# EasyEDA Pro project ProPrj_智能视觉集成板-V1.0.epro, schematic Schematic1

## Sheets
1 母版 连接器: Board Name: 母板; Create Date: 2024-11-23; Page Name: 母版 连接器; Project Name: 009-智能视觉集成板-V1.0; Schematic Name: Schematic1; Update Date: 2024-12-03; Company: 嘉立创EDA; Page Size: A4; Version: V1.0
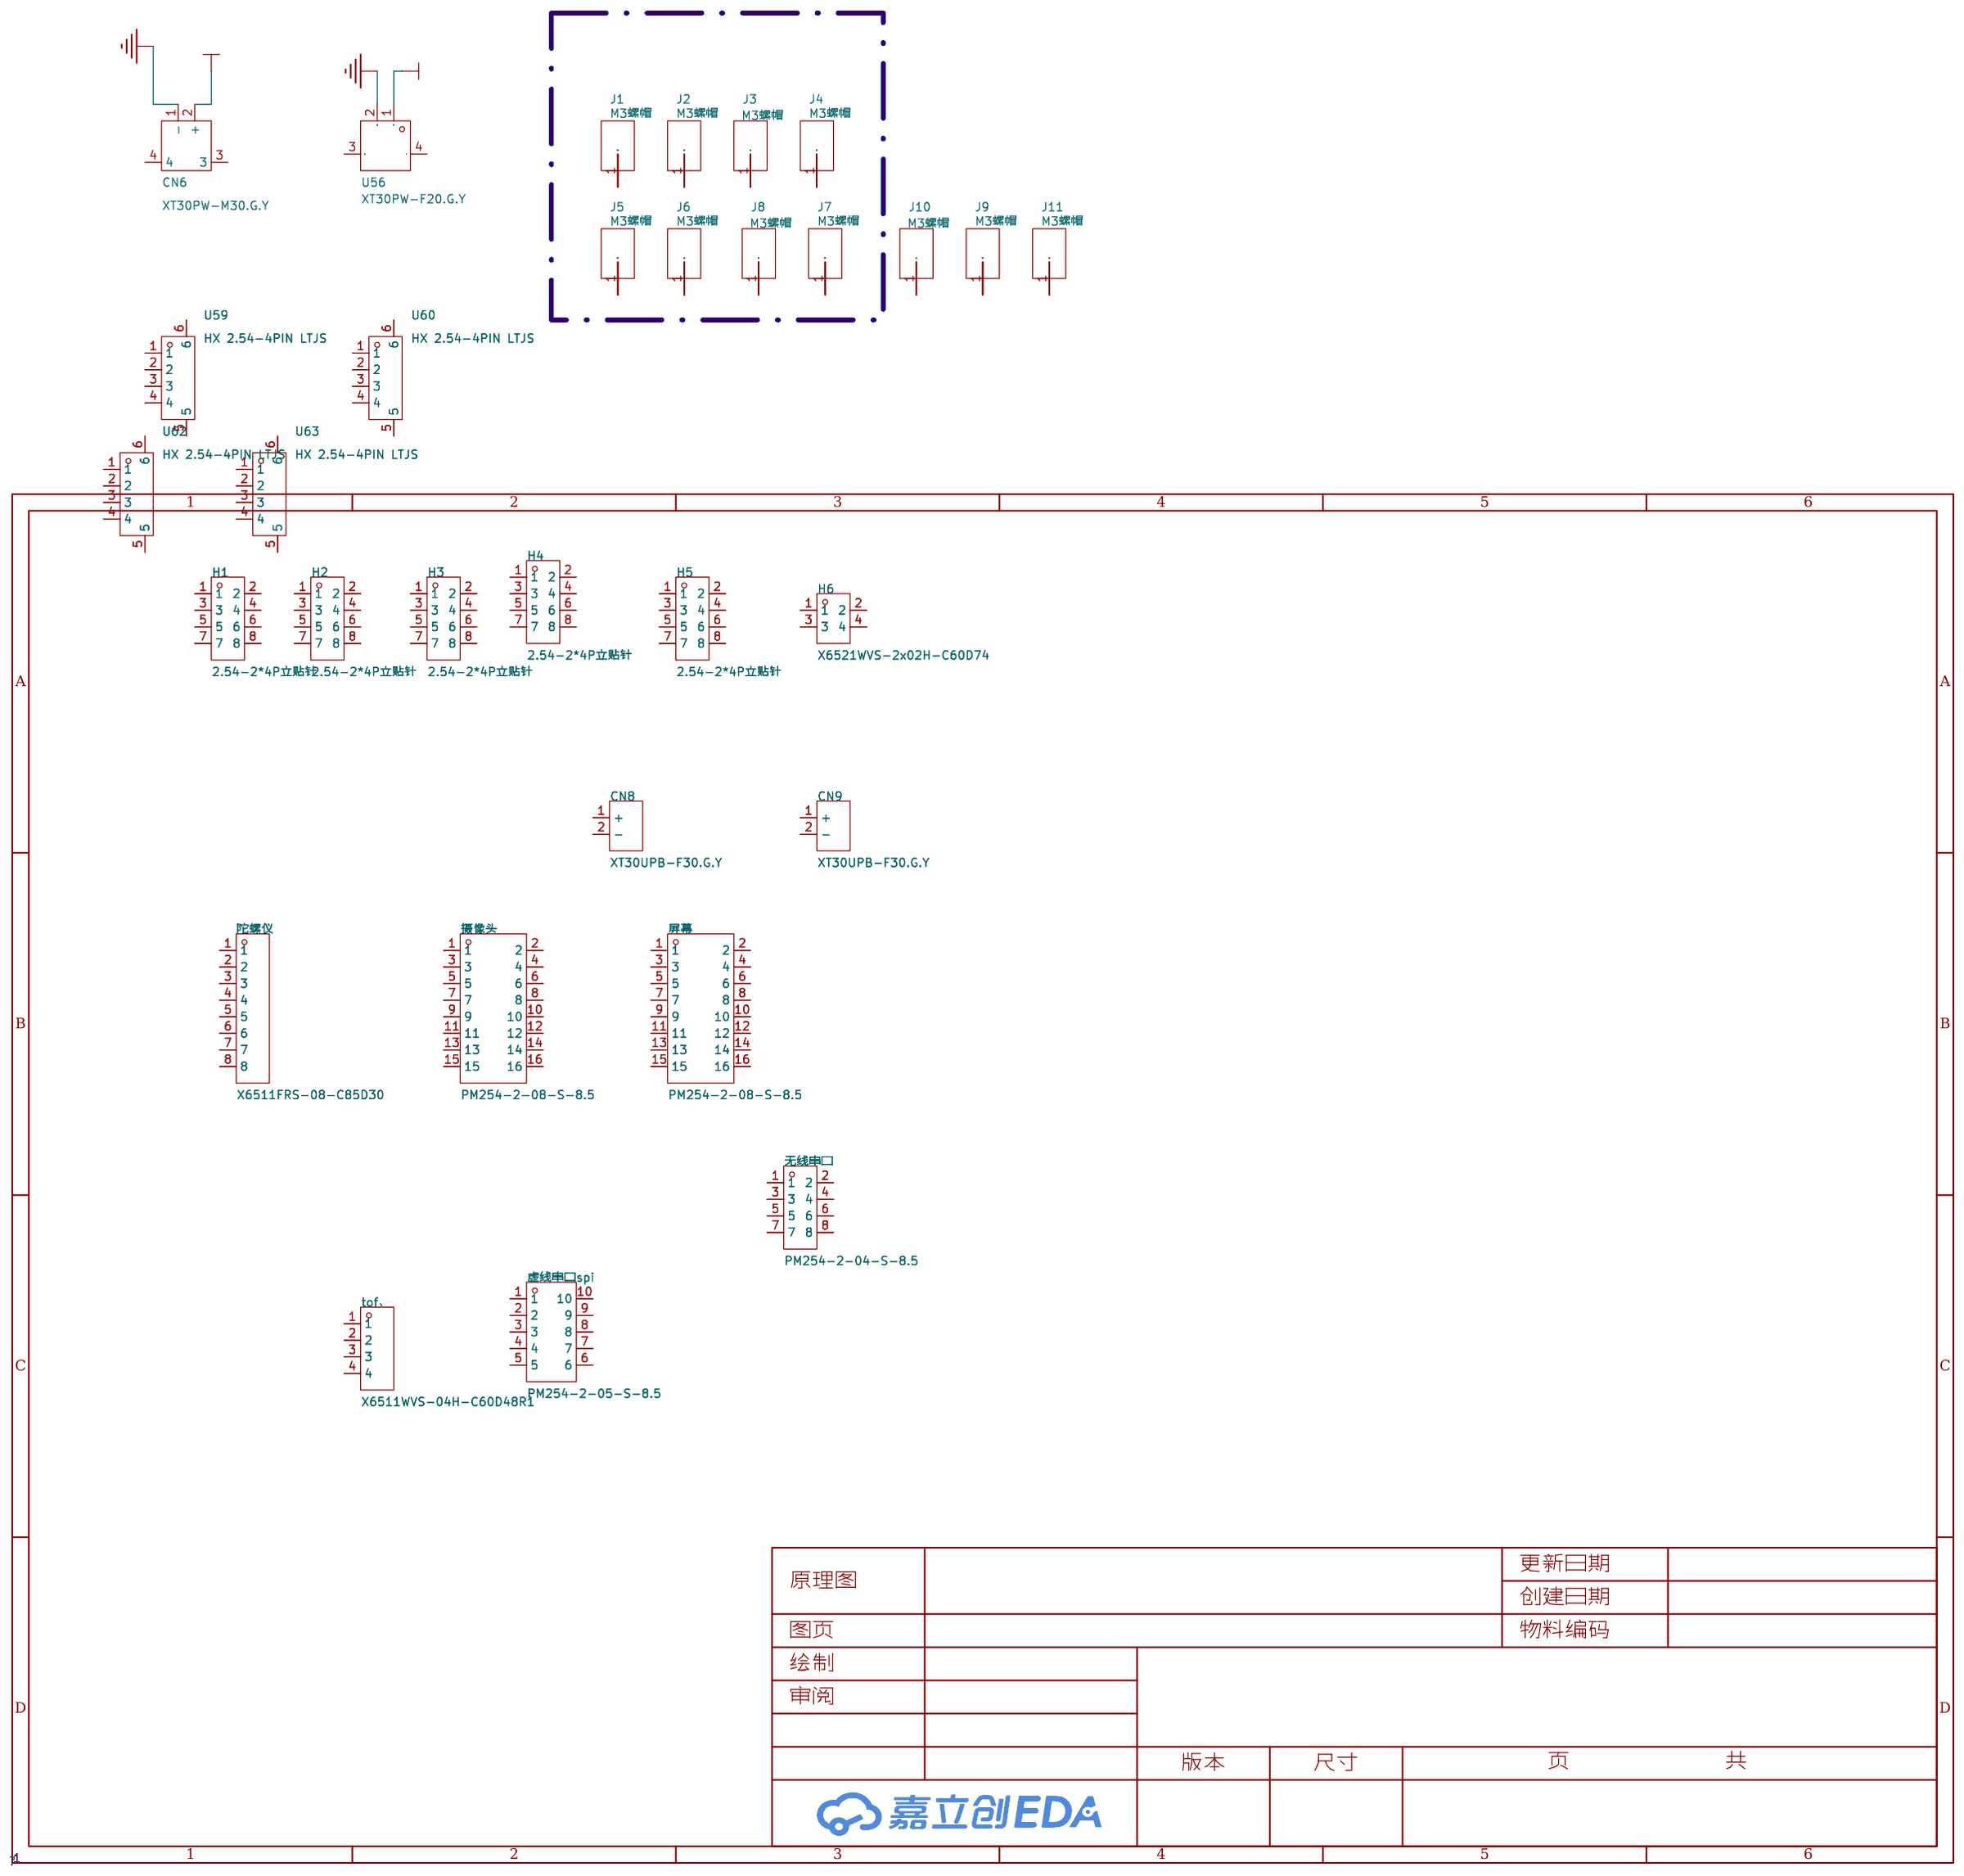
[diagram p0: 母版 连接器]
2 母版 电源: Create Date: 2024-12-03
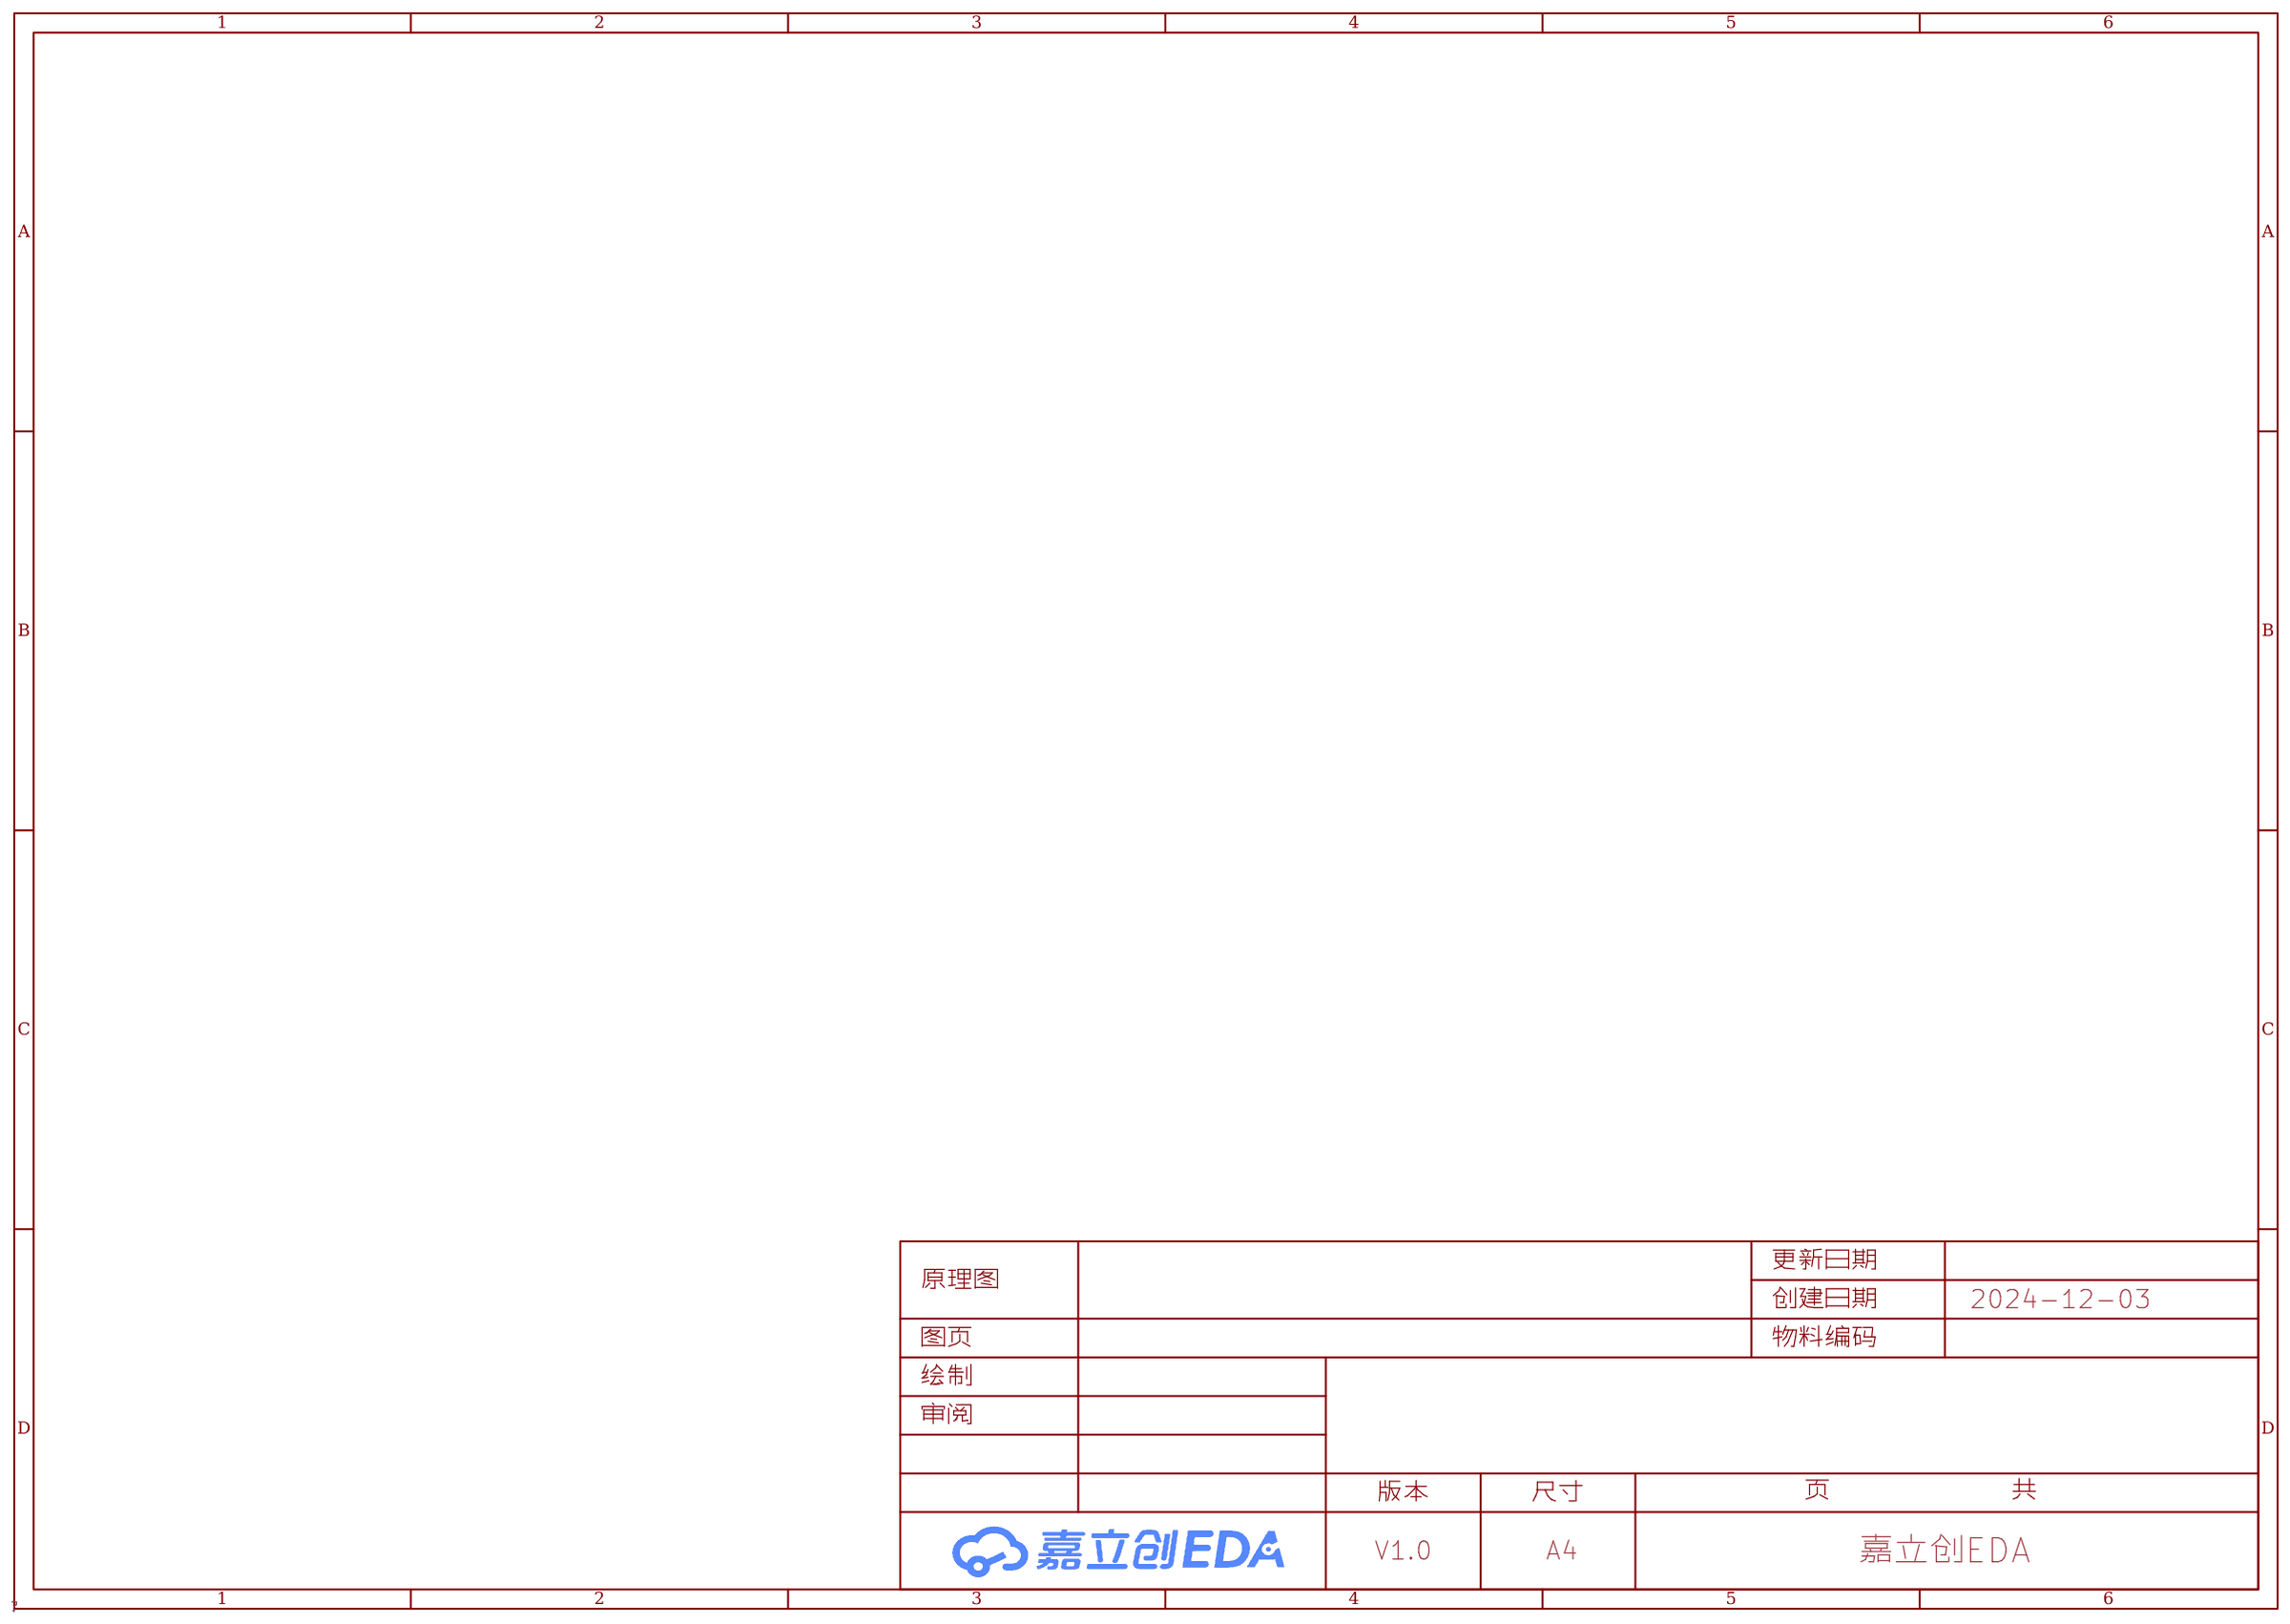
[diagram p1: 母版 电源]
3 母版 主板: Create Date: 2024-12-03; Page Name: 母版 主板
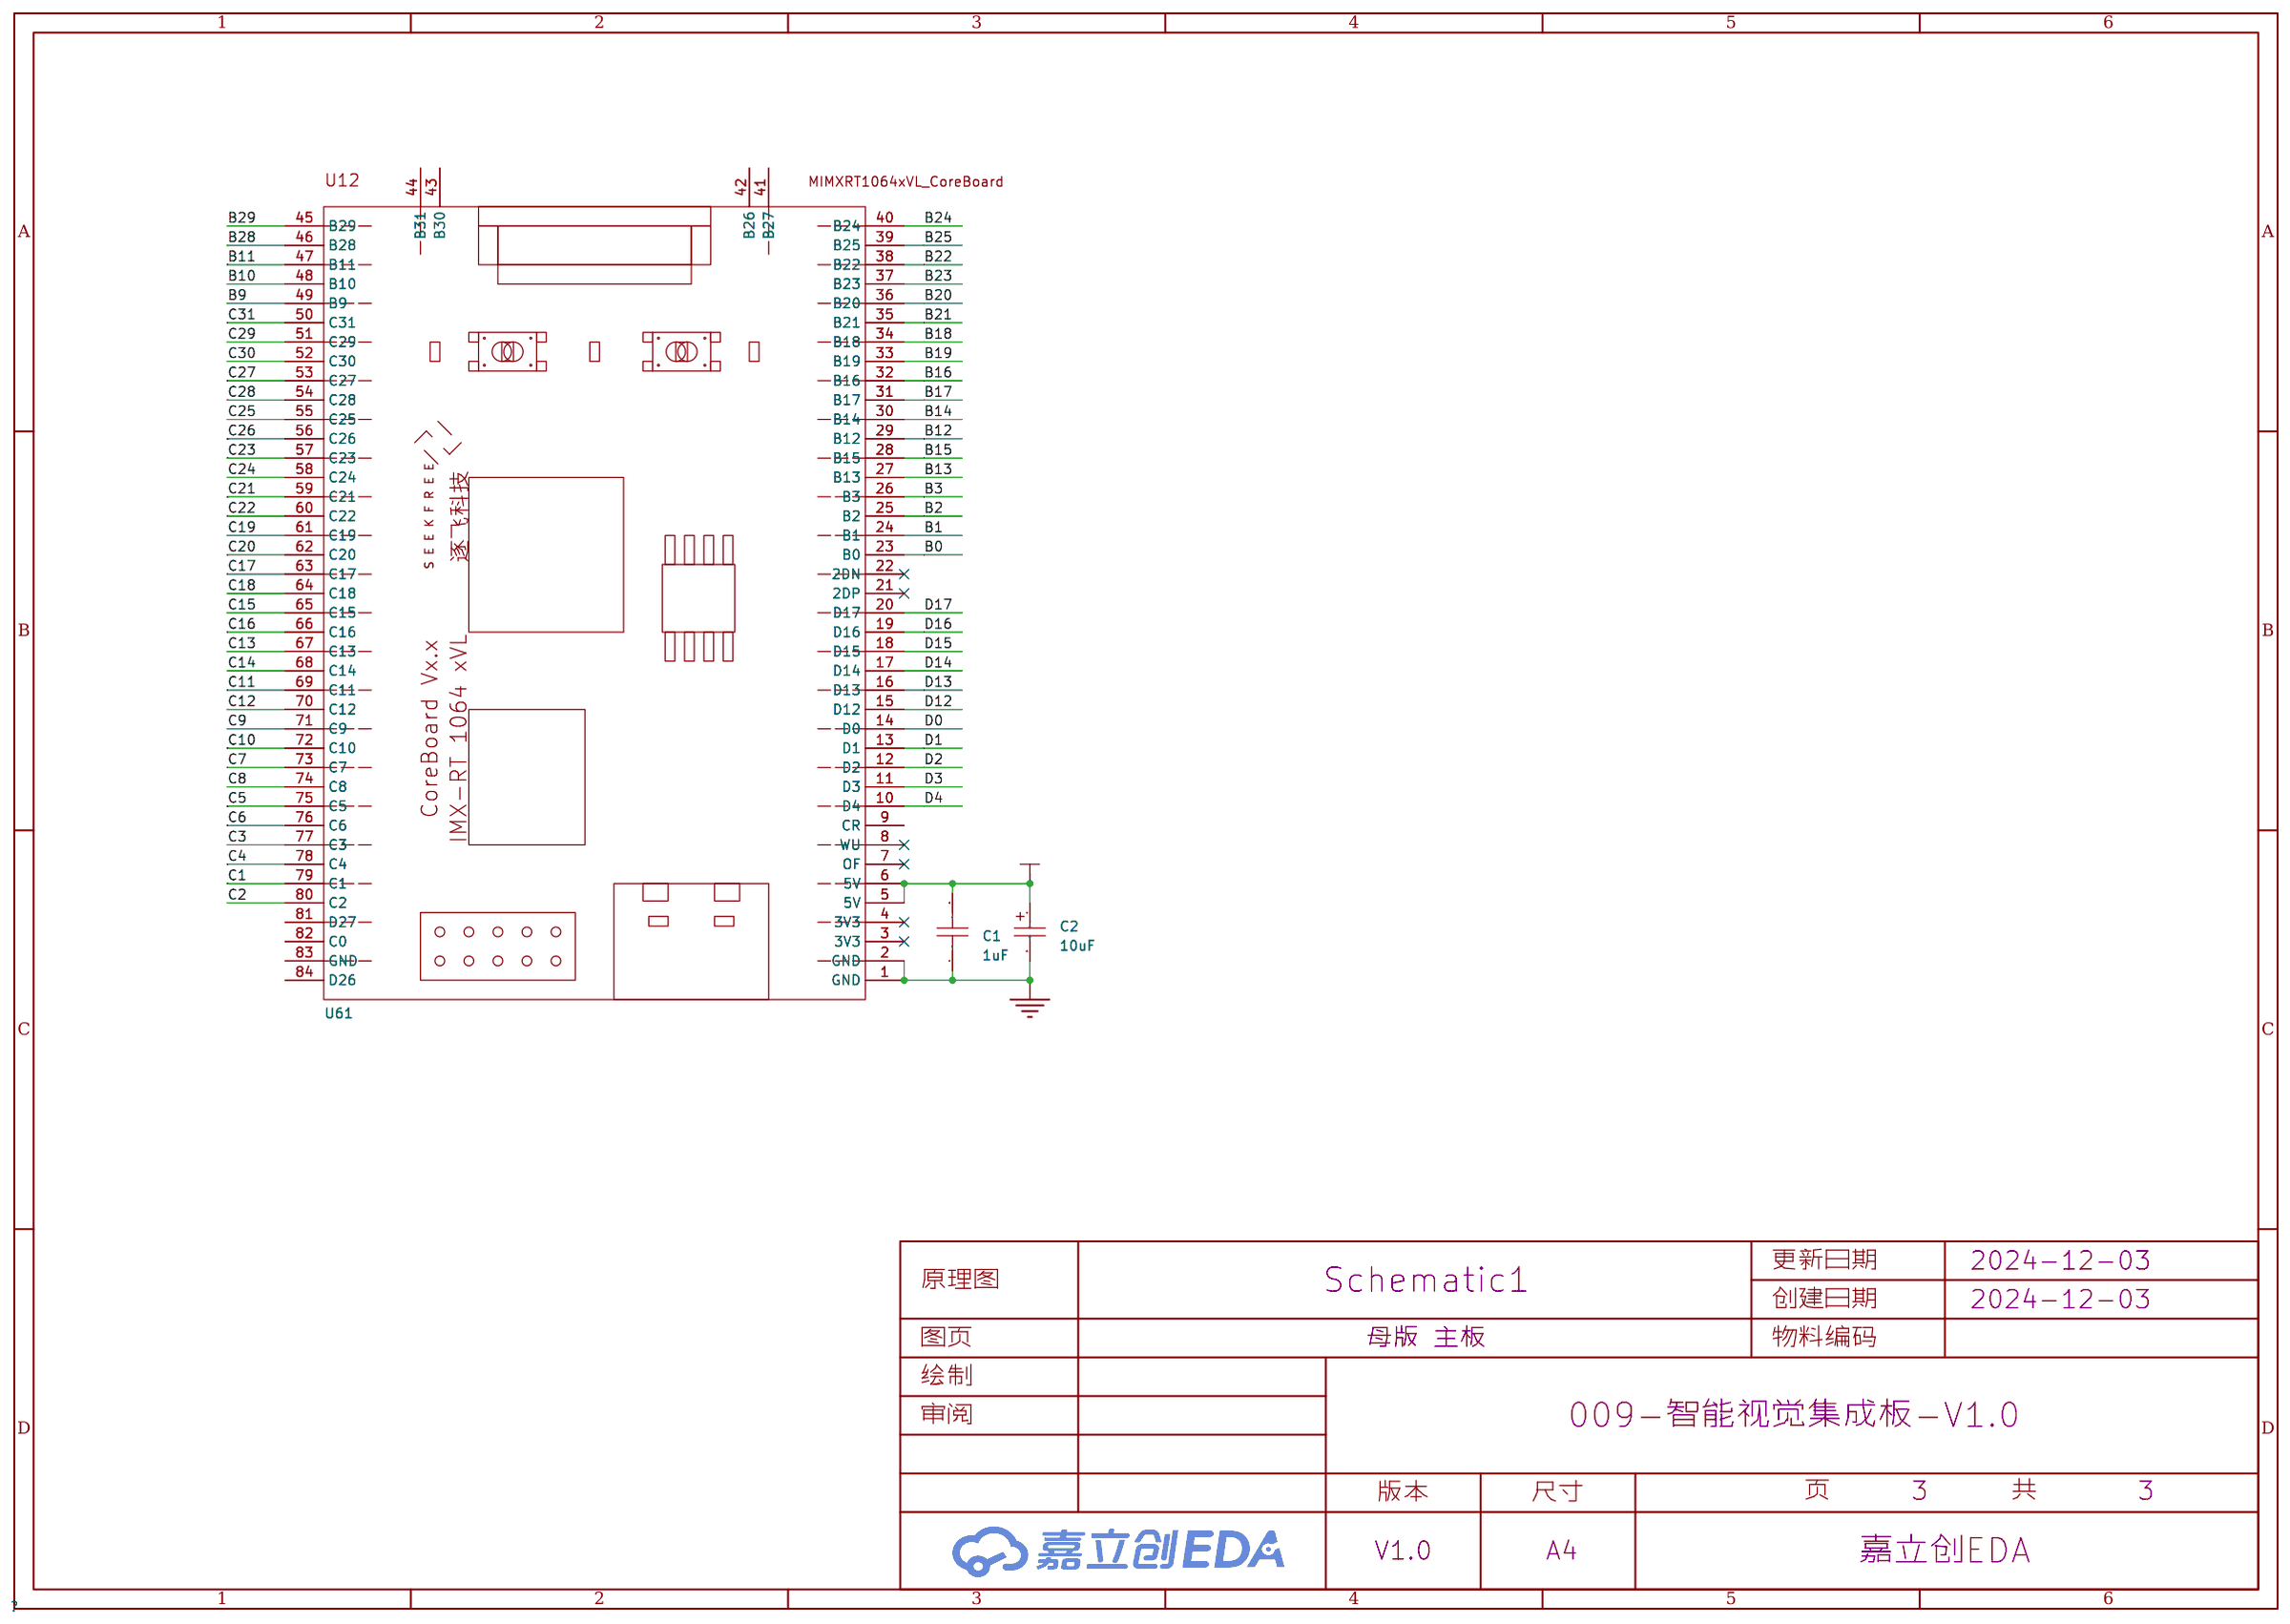
[diagram p2: 母版 主板]

## Parts
sheet 母版 主板
C1  1uF  [C0603]
C2  10uF  [CAP-SMD_L3.2-W1.6-RD-C7171]
U61  -  [MIMXRT1064xVL_CoreBoard - 3D]
sheet 母版 连接器
CN6  XT30PW-M30.G.Y  [CONN-TH_XT30PW-M]
CN8  XT30UPB-F30.G.Y  [CONN-TH_XT30UPB-F]
CN9  XT30UPB-F30.G.Y  [CONN-TH_XT30UPB-F]
H1  2.54-2*4P立贴针  [HDR-SMD_8P-P2.54-V-M-R2-C4-LS7.4]
H2  2.54-2*4P立贴针  [HDR-SMD_8P-P2.54-V-M-R2-C4-LS7.4]
H3  2.54-2*4P立贴针  [HDR-SMD_8P-P2.54-V-M-R2-C4-LS7.4]
H4  2.54-2*4P立贴针  [HDR-SMD_8P-P2.54-V-M-R2-C4-LS7.4]
H5  2.54-2*4P立贴针  [HDR-SMD_8P-P2.54-V-M-R2-C4-LS7.4]
H6  X6521WVS-2x02H-C60D74  [HDR-SMD_4P-P2.54-V-M-R2-C5-S7.4]
J1  M3螺帽  [M3螺帽]
J2  M3螺帽  [M3螺帽]
J3  M3螺帽  [M3螺帽]
J4  M3螺帽  [M3螺帽]
J5  M3螺帽  [M3螺帽]
J6  M3螺帽  [M3螺帽]
J7  M3螺帽  [M3螺帽]
J8  M3螺帽  [M3螺帽]
J9  M3螺帽  [M3螺帽]
J10  M3螺帽  [M3螺帽]
J11  M3螺帽  [M3螺帽]
tof、  X6511WVS-04H-C60D48R1  [HDR-SMD_4P-P2.54-V-M-S4.8]
U56  XT30PW-F20.G.Y  [CONN-TH_XT30PW-F-1]
U59  HX 2.54-4PIN LTJS  [CONN-SMD_4P-P2.54_HX-2.54-4PIN-LTJS]
U60  HX 2.54-4PIN LTJS  [CONN-SMD_4P-P2.54_HX-2.54-4PIN-LTJS]
U62  HX 2.54-4PIN LTJS  [CONN-SMD_4P-P2.54_HX-2.54-4PIN-LTJS]
U63  HX 2.54-4PIN LTJS  [CONN-SMD_4P-P2.54_HX-2.54-4PIN-LTJS]
屏幕  PM254-2-08-S-8.5  [HDR-SMD_16P-P2.54-V-F-R2-C8-LS7.1]
摄像头  PM254-2-08-S-8.5  [HDR-SMD_16P-P2.54-V-F-R2-C8-LS7.1]
无线串口  PM254-2-04-S-8.5  [HDR-SMD_8P-P2.54-V-F-R2-C4-S7.1]
虚线串口spi  PM254-2-05-S-8.5  [HDR-SMD_10P-P2.54-V-F-R2-C5-LS7.1-1]
陀螺仪  X6511FRS-08-C85D30  [HDR-SMD_8P-P2.54-H-F-L11.5]

## Library data of the parts
C1 = CGA0603X5R105K160JT: 容值:1uF;精度:±10%;额定电压:16V;材质(温度系数):X5R;; LCSC Part Name: 1uF ±10% 16V; Supplier Part: C6119849; Manufacturer: HRE(芯声); Supplier Footprint: 0603; JLCPCB Part Class: 扩展库; Supplier: LCSC; Tolerance: ±10%; Voltage Rated: 16V; Temperature Coefficient: X5R
C2 = TAJA106K016RNJ: 容值:10uF;精度:±10%;额定电压:16V;等效串联电阻:3Ω@100kHz;; LCSC Part Name: 10uF ±10% 16V; Supplier Part: C7171; Manufacturer: Kyocera AVX; Supplier Footprint: CASE-A-3216; JLCPCB Part Class: 基础库; Datasheet: https://atta.szlcsc.com/upload/public/pdf/source/20160107/1457707750344.pdf; Supplier: LCSC; Tolerance: ±10%; Rated Voltage: 16V; Equivalent Series Resistance(ESR): 3Ω@100kHz; Operating Temperature: -55℃~+125℃
U61 = 逐飞RT1064核心板
CN6 = XT30PW-M30.G.Y: 类别:-;类型1:-;; LCSC Part Name: AMASS(艾迈斯)航模插头 卧式弯脚 XT30PW-M公头; Supplier Part: C431092; Manufacturer: AMASS(艾迈斯); JLCPCB Part Class: 扩展库; Datasheet: https://atta.szlcsc.com/upload/public/pdf/source/20220222/6A9F22F7850E25B33E1BE430ADF8560B.pdf; Supplier: LCSC; Type: 航模插头; RatedVoltage: DC 500V; InterfaceType: 公头; RatedCurrent: 15A; RecommendedWireGauge: 16/18/20AWG; contact resistance: 1.2mΩ; specifications: 2pin
CN8 CN9 = XT30UPB-F30.G.Y: 类别:-;类型1:-;; LCSC Part Name: AMASS(艾迈斯)直立焊板式连接器XT30UPB30-F.G.*; Supplier Part: C108769; Manufacturer: AMASS(艾迈斯); JLCPCB Part Class: 扩展库; Datasheet: https://atta.szlcsc.com/upload/public/pdf/source/20220715/AFD68B9E8B6CA95A7295DBF4AF9325E4.pdf; Supplier: LCSC; Brand: 艾迈斯; Type: 航模插头; Colour: 黄色; RatedVoltage: DC 500V; InterfaceType: 母头; MetalMaterial: 镀金; InsulationMaterial: PA; RatedCurrent: 15A; contact resistance: 0.65mΩ
H1-H5 = 2.54-2*4P立贴针: 插针结构:2x4P;间距:2.54mm;行距:2.54mm;圆针/方针:方针;安装类型:立贴;排数:双排;总PIN位数:8P;额定电流:3A;额定电压:-;配合针长度:6mm;塑高:2.5mm;端接针长度:-;触头材质:-;触头镀层:-;工作温度范围:-55℃~+105℃;颜色:黑色;; LCSC Part Name: 间距:2.54mm 2x4P 立贴 方针; Supplier Part: C192300; Manufacturer: BOOMELE(博穆精密); Supplier Footprint: SMD,P=2.54mm; JLCPCB Part Class: 扩展库; Datasheet: https://atta.szlcsc.com/upload/public/pdf/source/20210812/F9D0E068B6990BF98BEA9D68FBD6ED36.pdf; Supplier: LCSC; Pin Structure: 2x4P; Pitch: 2.54mm; Row Spacing: 2.54mm; Circluar Pins/Square Pins: 方针; Mounting Type: 立贴; Number of Rows: 双排; Number of Pins: 8P; Current Rating (Max): 3A; Length of Mating Pin: 6mm; Insulation Height: 2.5mm; Operating Temperature Range: -55℃~+105℃; Color: 黑色
H6 = X6521WVS-2x02H-C60D74: 插针结构:2x2P;间距:2.54mm;行距:2.54mm;圆针/方针:方针;安装类型:-;排数:双排;总PIN位数:4P;额定电流:3A;额定电压:250V;配合针长度:-;塑高:2.5mm;端接针长度:-;触头材质:黄铜;触头镀层:金;工作温度范围:-40℃~+105℃;焊接温度(最大值):260℃;颜色:黑色;; LCSC Part Name: 2x2P 间距:2.54mm 方针; Supplier Part: C780055; Manufacturer: XKB Connection(中国星坤); Supplier Footprint: SMD,P=2.54mm; JLCPCB Part Class: 扩展库; Datasheet: https://atta.szlcsc.com/upload/public/pdf/source/20211009/E3239EE5247E6BAFECB8B74A4FCF9AB8.pdf; Supplier: LCSC; Pin Structure: 2x2P; Pitch: 2.54mm; Row Spacing: 2.54mm; Circluar Pins/Square Pins: 方针; Number of Rows: 双排; Number of Pins: 4P; Current Rating (Max): 3A; Voltage Rating (Max): 250V; Insulation Height: 2.5mm; Contact Material: 黄铜; Contact Plating: 金; Operating Temperature Range: -40℃~+105℃; Soldering Temperature(Max): 260℃; Color: 黑色
J1-J11 = M3螺帽
tof、 = X6511WVS-04H-C60D48R1: 插针结构:1x4P;间距:2.54mm;行距:2.54mm;圆针/方针:方针;安装类型:-;排数:单排;总PIN位数:4P;额定电流:3A;额定电压:250V;配合针长度:-;塑高:2.5mm;端接针长度:-;触头材质:黄铜;触头镀层:金;工作温度范围:-40℃~+105℃;焊接温度(最大值):260℃;颜色:黑色;; LCSC Part Name: 1x4P 间距:2.54mm 方针; Supplier Part: C780062; Manufacturer: XKB Connection(中国星坤); Supplier Footprint: SMD,P=2.54mm; JLCPCB Part Class: 扩展库; Datasheet: https://atta.szlcsc.com/upload/public/pdf/source/20220804/E423AB74ABBD410F84642849337C77AB.pdf; Supplier: LCSC; Pin Structure: 1x4P; Pitch: 2.54mm; Row Spacing: 2.54mm; Circluar Pins/Square Pins: 方针; Number of Rows: 单排; Number of Pins: 4P; Current Rating (Max): 3A; Voltage Rating (Max): 250V; Insulation Height: 2.5mm; Contact Material: 黄铜; Contact Plating: 金; Operating Temperature Range: -40℃~+105℃; Soldering Temperature(Max): 260℃; Color: 黑色
U56 = XT30PW-F20.G.Y: 类别:-;类型1:-;; LCSC Part Name: AMASS(艾迈斯)电源连接器 母头 XT30PW-F; Supplier Part: C2913282; Manufacturer: AMASS(艾迈斯); JLCPCB Part Class: 扩展库; Datasheet: https://atta.szlcsc.com/upload/public/pdf/source/20231218/06CFCF98887A9A87638B0856A725C8FD.pdf; Supplier: LCSC; Type: 航模插头; InterfaceType: 母头
U59 U60 U62 U63 = HX 2.54-4PIN LTJS: 插针结构:1x4P;间距:2.5mm;安装方式:立贴;总PIN数:4P;排数:1;每排PIN数:4;额定电流:3A;工作温度范围:-25℃~+85℃;; Supplier Part: C19270026; Manufacturer: hanxia(韩下); Supplier Footprint: SMD,P=2.5mm; JLCPCB Part Class: 扩展库; Datasheet: https://atta.szlcsc.com/upload/public/pdf/source/20231127/C4D3287CC75559A6A8A5937D0950CE7D.pdf; Supplier: LCSC; Pins Structure: 1x4P; Pitch: 2.5mm; Mounting Style: 立贴; Number of Pins: 4P; Number of Rows: 1; Number of PINs Per Row: 4; Current Rating (Max): 3A; Operating Temperature Range: -25℃~+85℃
屏幕 摄像头 = PM254-2-08-S-8.5: 插孔结构:2x8P;间距:2.54mm;行距:2.54mm;圆孔/方孔:方孔;安装类型:立贴;排数:双排;总孔位数:16P;额定电流:3A;插孔方向:顶部;塑高:8.5mm;触头材质:铜合金;工作温度范围:-40℃~+105℃;焊接温度(最大值):260℃@5S;; LCSC Part Name: 2x8P 间距:2.54mm 立贴; Supplier Part: C3975153; Manufacturer: HCTL(华灿天禄); Supplier Footprint: SMD,P=2.54mm; JLCPCB Part Class: 扩展库; Datasheet: https://atta.szlcsc.com/upload/public/pdf/source/20230609/7C6F8D8E301C6BBC8F19D55951C36597.pdf; Supplier: LCSC; Holes Structure: 2x8P; Pitch: 2.54mm; Row Spacing: 2.54mm; Circular Hole / Square Hole: 方孔; Mounting Type: 立贴; Number of Rows: 双排; Number of Holes: 16P; Current Rating (Max): 3A; Holes Direction: 顶部; Insulation Height: 8.5mm; Contact Material: 铜合金; Operating Temperature Range: -40℃~+105℃; Soldering Temperature(Max): 260℃@5S
无线串口 = PM254-2-04-S-8.5: 插孔结构:2x4P;间距:2.54mm;行距:2.54mm;圆孔/方孔:方孔;安装类型:立贴;排数:双排;总孔位数:8P;额定电流:3A;插孔方向:顶部;塑高:8.5mm;触头材质:铜合金;工作温度范围:-40℃~+105℃;焊接温度(最大值):260℃@5S;; LCSC Part Name: 2x4P 间距:2.54mm 立贴; Supplier Part: C3975149; Manufacturer: HCTL(华灿天禄); Supplier Footprint: SMD,P=2.54mm; JLCPCB Part Class: 扩展库; Datasheet: https://atta.szlcsc.com/upload/public/pdf/source/20230609/7C6F8D8E301C6BBC8F19D55951C36597.pdf; Supplier: LCSC; Holes Structure: 2x4P; Pitch: 2.54mm; Row Spacing: 2.54mm; Circular Hole / Square Hole: 方孔; Mounting Type: 立贴; Number of Rows: 双排; Number of Holes: 8P; Current Rating (Max): 3A; Holes Direction: 顶部; Insulation Height: 8.5mm; Contact Material: 铜合金; Operating Temperature Range: -40℃~+105℃; Soldering Temperature(Max): 260℃@5S
虚线串口spi = PM254-2-05-S-8.5: 插孔结构:2x5P;间距:2.54mm;行距:2.54mm;圆孔/方孔:方孔;安装类型:立贴;排数:双排;总孔位数:10P;额定电流:3A;插孔方向:顶部;塑高:8.5mm;触头材质:铜合金;工作温度范围:-40℃~+105℃;焊接温度(最大值):260℃@5S;; LCSC Part Name: 2x5P 间距:2.54mm 立贴; Supplier Part: C3975150; Manufacturer: HCTL(华灿天禄); Supplier Footprint: SMD,P=2.54mm; JLCPCB Part Class: 扩展库; Datasheet: https://atta.szlcsc.com/upload/public/pdf/source/20230609/7C6F8D8E301C6BBC8F19D55951C36597.pdf; Supplier: LCSC; Holes Structure: 2x5P; Pitch: 2.54mm; Row Spacing: 2.54mm; Circular Hole / Square Hole: 方孔; Mounting Type: 立贴; Number of Rows: 双排; Number of Holes: 10P; Current Rating (Max): 3A; Holes Direction: 顶部; Insulation Height: 8.5mm; Contact Material: 铜合金; Operating Temperature Range: -40℃~+105℃; Soldering Temperature(Max): 260℃@5S
陀螺仪 = X6511FRS-08-C85D30: 插孔结构:1x8P;间距:2.54mm;安装类型:卧贴;排数:单排;总孔位数:8P;塑高:8.5mm;; LCSC Part Name: 间距:2.54mm 1x8P 卧贴; Supplier Part: C5142241; Manufacturer: XKB Connectivity(中国星坤); Supplier Footprint: SMD,P=2.54mm,卧贴; JLCPCB Part Class: 扩展库; Datasheet: https://atta.szlcsc.com/upload/public/pdf/source/20220822/AB9A82E80C220285963E5EFA3BFD32FF.pdf; Supplier: LCSC; Holes Structure: 1x8P; Pitch: 2.54mm; Mounting Type: 卧贴; Number of Rows: 单排; Number of Holes: 8P; Insulation Height: 8.5mm

## Nets
GND_MAIN: C1.1 C2.2 U61.1(GND) U61.2(GND)
VCC_+5V: C1.2 C2.1 U61.5(5V) U61.6(5V)
VCCBAT: CN6.2(+) U56.1
B0: U61.23(B0)
B1: U61.24(B1)
B2: U61.25(B2)
B3: U61.26(B3)
B9: U61.49(B9)
B10: U61.48(B10)
B11: U61.47(B11)
B12: U61.29(B12)
B13: U61.27(B13)
B14: U61.30(B14)
B15: U61.28(B15)
B16: U61.32(B16)
B17: U61.31(B17)
B18: U61.34(B18)
B19: U61.33(B19)
B20: U61.36(B20)
B21: U61.35(B21)
B22: U61.38(B22)
B23: U61.37(B23)
B24: U61.40(B24)
B25: U61.39(B25)
B28: U61.46(B28)
B29: U61.45(B29)
BATGND: CN6.1(-) U56.2
C1: U61.79(C1)
C2: U61.80(C2)
C3: U61.77(C3)
C4: U61.78(C4)
C5: U61.75(C5)
C6: U61.76(C6)
C7: U61.73(C7)
C8: U61.74(C8)
C9: U61.71(C9)
C10: U61.72(C10)
C11: U61.69(C11)
C12: U61.70(C12)
C13: U61.67(C13)
C14: U61.68(C14)
C15: U61.65(C15)
C16: U61.66(C16)
C17: U61.63(C17)
C18: U61.64(C18)
C19: U61.61(C19)
C20: U61.62(C20)
C21: U61.59(C21)
C22: U61.60(C22)
C23: U61.57(C23)
C24: U61.58(C24)
C25: U61.55(C25)
C26: U61.56(C26)
C27: U61.53(C27)
C28: U61.54(C28)
C29: U61.51(C29)
C30: U61.52(C30)
C31: U61.50(C31)
D0: U61.14(D0)
D1: U61.13(D1)
D2: U61.12(D2)
D3: U61.11(D3)
D4: U61.10(D4)
D12: U61.15(D12)
D13: U61.16(D13)
D14: U61.17(D14)
D15: U61.18(D15)
D16: U61.19(D16)
D17: U61.20(D17)

Not connected (* = marked no-connect by the designer): CN6 3 4; CN8 1(+) 2(-); CN9 1(+) 2(-); H1 1 2 3 4 5 6 7 8; H2 1 2 3 4 5 6 7 8; H3 1 2 3 4 5 6 7 8; H4 1 2 3 4 5 6 7 8; H5 1 2 3 4 5 6 7 8; H6 1 2 3 4; J1 1; J2 1; J3 1; J4 1; J5 1; J6 1; J7 1; J8 1; J9 1; J10 1; J11 1; tof、 1 2 3 4; U56 3 4; U59 1 2 3 4 5 6; U60 1 2 3 4 5 6; U61 3(3V3)* 4(3V3)* 7(OF)* 8(WU)* 9(CR) 21(2DP)* 22(2DN)* 41(B27) 42(B26) 43(B30) 44(B31) 81(D27) 82(C0) 83(GND) 84(D26); U62 1 2 3 4 5 6; U63 1 2 3 4 5 6; 屏幕 1 2 3 4 5 6 7 8 9 10 11 12 13 14 15 16; 摄像头 1 2 3 4 5 6 7 8 9 10 11 12 13 14 15 16; 无线串口 1 2 3 4 5 6 7 8; 虚线串口spi 1 2 3 4 5 6 7 8 9 10; 陀螺仪 1 2 3 4 5 6 7 8
